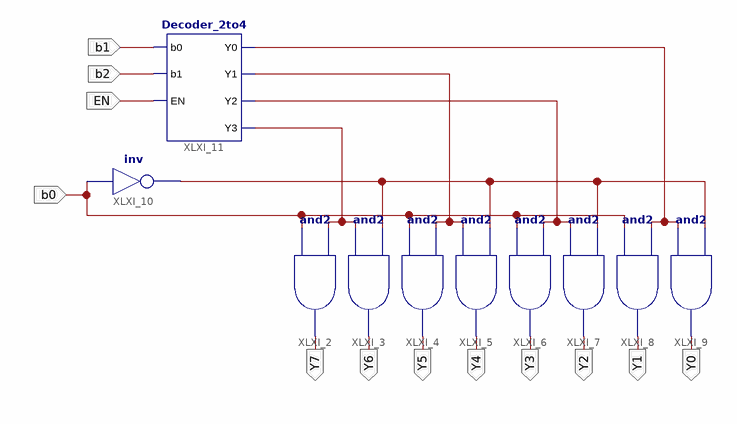
[diagram p0: schematic sheet 1]
// Xilinx ISE schematic Decoder_3to8.sch (spartan3e) as structural Verilog: 10 symbols, 12 ports
module Decoder_3to8 (
  input  b0,
  input  b1,
  input  b2,
  input  EN,
  output Y7,
  output Y6,
  output Y5,
  output Y4,
  output Y3,
  output Y2,
  output Y1,
  output Y0
);

  wire XLXN_1, XLXN_5, XLXN_10, XLXN_23, XLXN_24;

  and XLXI_2 (Y7, b0, XLXN_1);
  and XLXI_3 (Y6, XLXN_1, XLXN_10);
  and XLXI_4 (Y5, b0, XLXN_23);
  and XLXI_5 (Y4, XLXN_23, XLXN_10);
  and XLXI_6 (Y3, b0, XLXN_24);
  and XLXI_7 (Y2, XLXN_24, XLXN_10);
  and XLXI_8 (Y1, b0, XLXN_5);
  and XLXI_9 (Y0, XLXN_5, XLXN_10);
  not XLXI_10 (XLXN_10, b0);
  Decoder_2to4 XLXI_11 (.b0(b1), .b1(b2), .EN(EN), .Y0(XLXN_5), .Y1(XLXN_23), .Y2(XLXN_24), .Y3(XLXN_1));
endmodule
